# EAGLE design pcb_organizer_sch (EAGLE 9.4.2)
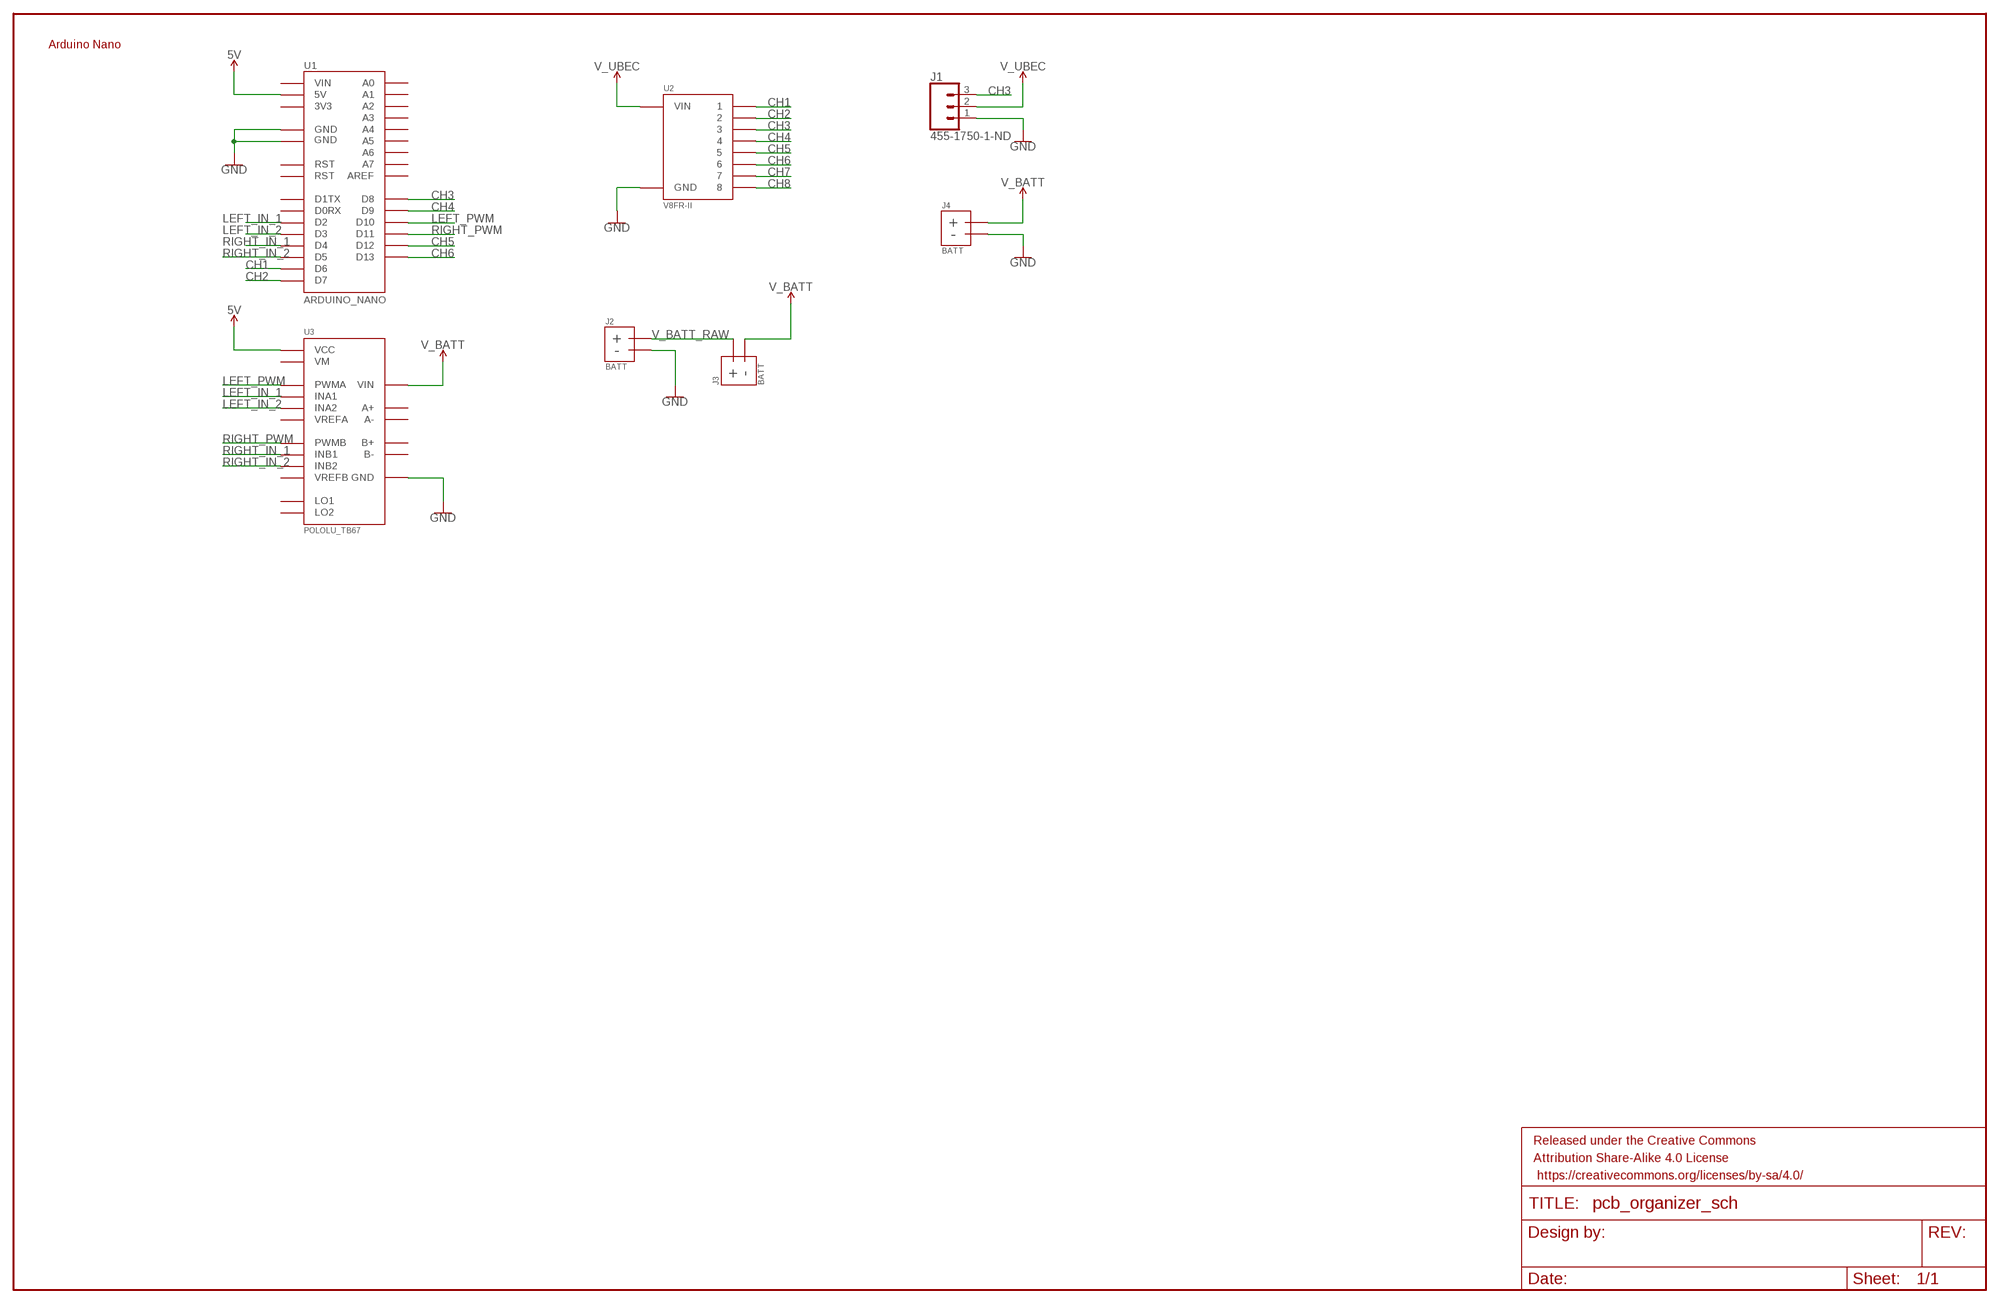
[diagram p0: schematic, sheet 1]

## Parts
FRAME1  FRAME-LEDGER  [CREATIVE_COMMONS]
J1  455-1750-1-ND  CONN_03  [1X03]
J2  BATT  [CONN_2_10AUG]
J3  BATT  [CONN_2_10AUG]
J4  BATT  [CONN_2_10AUG]
U1  ARDUINO_NANO  [ARDUINO_NANO]
U2  V8FR-II  [V8FR-II]
U3  POLOLU_TB67  [POLOLU_TB67]

## Nets
5V: U1.5V U3.VCC
CH1: U1.D6 U2.1
CH2: U1.D7 U2.2
CH3: J1.3 U1.D8 U2.3
CH4: U1.D9 U2.4
CH5: U1.D12 U2.5
CH6: U1.D13 U2.6
CH7: U2.7
CH8: U2.8
GND: J1.1 J2.- J4.- U1.GND U1.GND_@16(GND) U2.GND_1(GND) U2.GND_2(GND) U2.GND_3(GND) U2.GND_4(GND) U2.GND_5(GND) U2.GND_6(GND) U2.GND_7(GND) U2.GND_8(GND) U3.GND U3.GND@14(GND) U3.GND@15(GND)
LEFT_IN_1: U1.D2 U3.INA1
LEFT_IN_2: U1.D3 U3.INA2
LEFT_PWM: U1.D10 U3.PWMA
RIGHT_IN_1: U1.D4 U3.INB1
RIGHT_IN_2: U1.D5 U3.INB2
RIGHT_PWM: U1.D11 U3.PWMB
V_BATT: J3.- J4.+ U3.VIN
V_BATT_RAW: J2.+ J3.+
V_UBEC: J1.2 U2.VIN_1(VIN) U2.VIN_2(VIN) U2.VIN_3(VIN) U2.VIN_4(VIN) U2.VIN_5(VIN) U2.VIN_6(VIN) U2.VIN_7(VIN) U2.VIN_8(VIN)
Unconnected: U1.3V3 U1.A0 U1.A1 U1.A2 U1.A3 U1.A4 U1.A5 U1.A6 U1.A7 U1.AREF U1.D0RX U1.D1TX U1.RST U1.RST@17(RST) U1.VIN U3.A+ U3.A- U3.B+ U3.B- U3.LO1 U3.LO2 U3.VM U3.VREFA U3.VREFB

## Notes on the sheet
- Arduino Nano

## Library data of the parts
FRAME1 = SparkFun-Aesthetics:FRAME-LEDGER: Schematic Frame - Ledger Standard 11x14 US Ledger frame
J1 = SparkFun-Connectors:CONN_03: Multi connection point. Often used as Generic Header-pin footprint for 0.1 inch spaced/style header connections On any of the 0.1 inch spaced packages, you can populate with these: Break Away Headers - Straight <https://www.sparkfun.com/products/116> (PRT-00116) Break Away Male Headers - Right Angle <https://www.sparkfun.com/products/553> (PRT-00553) Female Headers <https://www.sparkfun.com/products/115> (PRT-00115) Break Away Headers - Machine Pin <https://www.sparkfun.com/products/117> (PRT-00117) Break Away Female Headers - Swiss Machine Pin <https://www.sparkfun.com/products/743> (PRT-00743) Stackable Header - 3 Pin (Female, 0.1") <https://www.sparkfun.com/products/13875> (PRT-13875) For SCREWTERMINALS and SPRING TERMINALS visit here: Screw Terimnals on SparkFun.com <https://www.sparkfun.com/search/results?term=Screw+Terminals> (5mm/3.5mm/2.54mm spacing) This device is also useful as a general connection point to wire up your design to another part of your project. Our various solder wires solder well into these plated through hole pads. Hook-Up Wire - Assortment (Stranded, 22 AWG) <https://www.sparkfun.com/products/11375> (PRT-11375) Hook-Up Wire - Assortment (Solid Core, 22 AWG) <https://www.sparkfun.com/products/11367> (PRT-11367) View the entire wire category on our website here <https://www.sparkfun.com/categories/141> Special notes: Molex polarized connector foot print use with SKU : PRT-08232 with associated crimp pins and housings.; PROD_ID: XXX-00000
J2-J4 = CUCombatBots:BATT
U1 = CUCombatBots:ARDUINO_NANO
U2 = CUCombatBots:V8FR-II
U3 = CUCombatBots:POLOLU_TB67

## Board
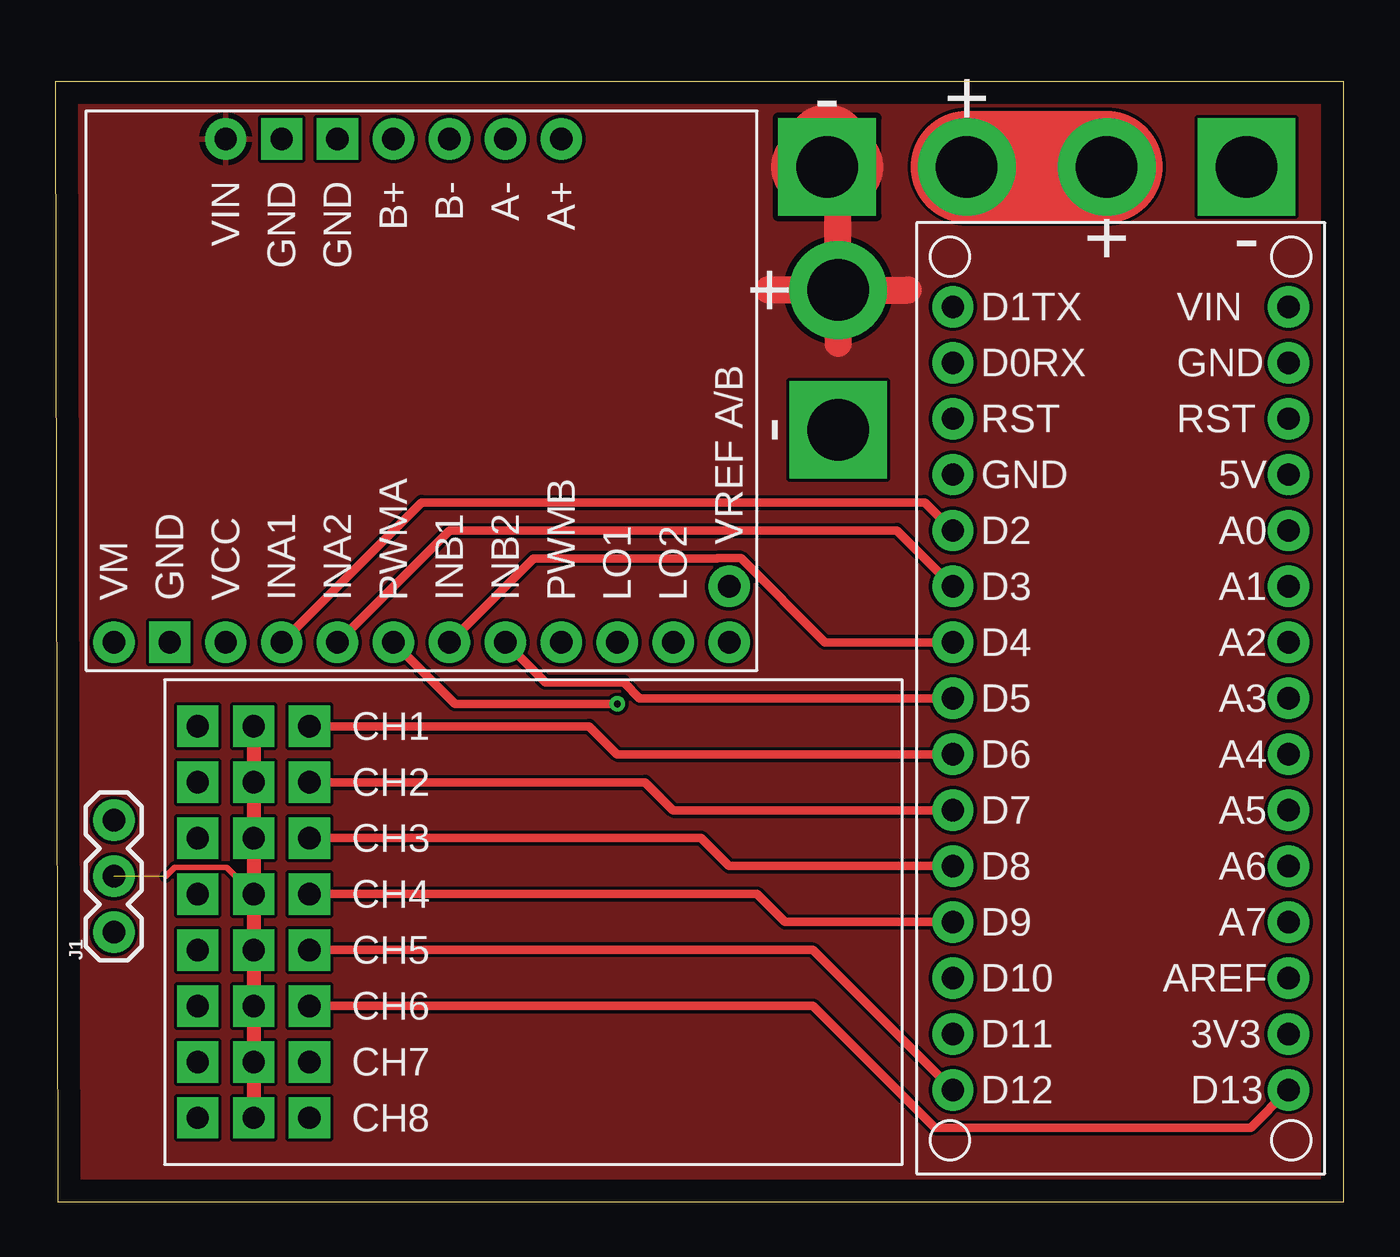
[diagram p1: board, top side]
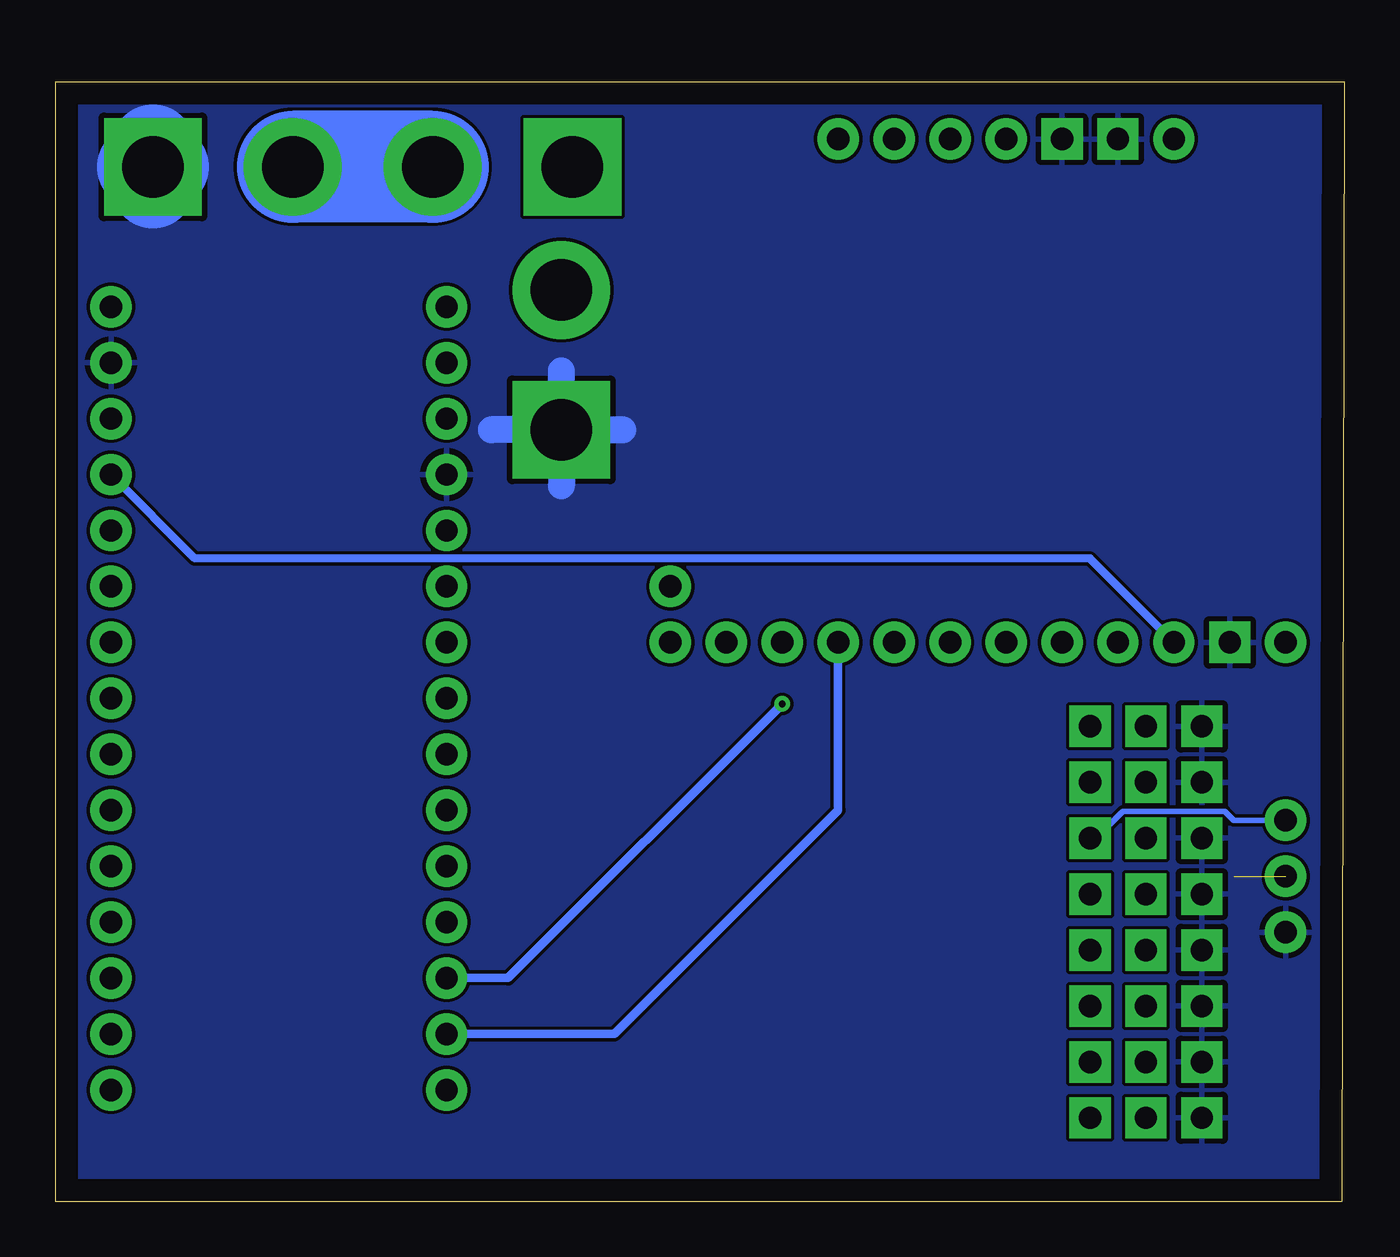
[diagram p2: board, bottom side, seen from below]

Size 58.53 x 50.85 mm. Coordinates in mm from the lower left corner, seen from the top.
Outline: 0.13,0 58.53,0 58.53,50.85 0,50.85 0.13,0
Copper layers (1*16): Top 0.035mm / dielectric 1.5mm / Bottom 0.035mm
Design rules "default *": minimum track width 6mil, minimum drill 3mil, track to track 6mil, track to pad 6mil, pad to pad 6mil, via to via 6mil, smd to smd 6mil, copper to edge 40mil, drill to drill 6mil, minimum pad ring 10mil, minimum via ring 8mil, stop-mask expansion 4mil, vias tented up to drill 0mil, thermal gap 10mil

### Footprints (pad centres in the part's own frame; a part is rotated, then mirrored left to right if it is on the bottom)
1X03 = drill 1.016 pad 1.88: 1 0,0; 2 2.54,0; 3 5.08,0
CONN_2_10AUG = drill 2.794 pad 4.445: + 3.175,0 | drill 2.794 pad 4.445 square: - -3.175,0
ARDUINO_NANO = drill 1.016 pad 1.88: 3V3 7.62,-15.24; 5V 7.62,10.16; A0 7.62,7.62; A1 7.62,5.08; A2 7.62,2.54; A3 7.62,0; A4 7.62,-2.54; A5 7.62,-5.08; A6 7.62,-7.62; A7 7.62,-10.16; AREF 7.62,-12.7; D0RX -7.62,15.24; D1TX -7.62,17.78; D2 -7.62,7.62; D3 -7.62,5.08; D4 -7.62,2.54; D5 -7.62,0; D6 -7.62,-2.54; D7 -7.62,-5.08; D8 -7.62,-7.62; D9 -7.62,-10.16; D10 -7.62,-12.7; D11 -7.62,-15.24; D12 -7.62,-17.78; D13 7.62,-17.78; GND -7.62,10.16; GND_@16 7.62,15.24; RST -7.62,12.7; RST@17 7.62,12.7; VIN 7.62,17.78
V8FR-II = drill 1.016 pad 1.88 square: 1 8.89,10.16; 2 6.35,10.16; 3 3.81,10.16; 4 1.27,10.16; 5 -1.27,10.16; 6 -3.81,10.16; 7 -6.35,10.16; 8 -8.89,10.16; GND_1 8.89,15.24; GND_2 6.35,15.24; GND_3 3.81,15.24; GND_4 1.27,15.24; GND_5 -1.27,15.24; GND_6 -3.81,15.24; GND_7 -6.35,15.24; GND_8 -8.89,15.24; VIN_1 8.89,12.7; VIN_2 6.35,12.7; VIN_3 3.81,12.7; VIN_4 1.27,12.7; VIN_5 -1.27,12.7; VIN_6 -3.81,12.7; VIN_7 -6.35,12.7; VIN_8 -8.89,12.7
POLOLU_TB67 = drill 1.016 pad 1.88: A+ 11.43,-6.35; A- 11.43,-3.81; B+ 11.43,1.27; B- 11.43,-1.27; INA1 -11.43,6.35; INA2 -11.43,3.81; INB1 -11.43,-1.27; INB2 -11.43,-3.81; LO1 -11.43,-8.89; LO2 -11.43,-11.43; PWMA -11.43,1.27; PWMB -11.43,-6.35; VCC -11.43,8.89; VIN 11.43,8.89; VM -11.43,13.97; VREFA -11.43,-13.97; VREFB -8.89,-13.97 | drill 1.016 pad 1.88 square: GND -11.43,11.43; GND@14 11.43,6.35; GND@15 11.43,3.81

### Placement (x,y rotation side)
FRAME1  -36.7,45.72 0 top  (outside the outline)
J1  2.67,12.24 90 top
J2  50.93,46.99 180 top
J3  38.23,46.99 0 top
J4  35.56,38.23 90 top
U1  48.39,22.86 0 top
U2  21.72,12.7 90 top
U3  16.64,36.83 90 top

### Tracks (layer width: path | path; a pad name or v marks a point on that pad's centre or on a via)
5V
  Bottom 0.356: U3.VCC 11.56,29.21 52.2,29.21 U1.5V
CH1
  Top 0.381: U2.1 24.26,21.59 25.53,20.32 U1.D6
CH2
  Top 0.381: U2.2 26.8,19.05 28.07,17.78 U1.D7
CH3
  Top 0.381: U2.3 29.34,16.51 30.61,15.24 U1.D8
  Bottom 0.254: U2.3 11.29,16.51 10.07,17.73 5.42,17.73 5.01,17.32 J1.3
CH4
  Top 0.381: U2.4 31.88,13.97 33.15,12.7 U1.D9
CH5
  Top 0.381: U1.D12 34.42,11.43 U2.5
CH6
  Top 0.381: U2.6 34.42,8.89 39.94,3.37 54.29,3.37 U1.D13
GND
  Bottom 1.219: J4.- 35.56,37.72 | J4.- 38.73,35.05 | J4.- 35.56,32.51 | J4.- 32.77,35.05
  Bottom 3.81: J2.- 54.74,46.99 | J2.- 53.47,46.99 | J2.- 54.1,47.93 | J2.- 54.1,46.1
  pour Bottom: 0.13,0 58.55,0 58.55,50.8 0.13,50.8
LEFT_IN_1
  Top 0.381: U3.INA1 16.64,31.75 39.5,31.75 U1.D2
LEFT_IN_2
  Top 0.381: U3.INA2 17.91,30.48 38.23,30.48 U1.D3
LEFT_PWM  (via drill 0.3)
  Top 0.381: U3.PWMA 18.16,22.61 v25.53,22.61
  Bottom 0.381: v25.53,22.61 37.97,10.16 U1.D10
RIGHT_IN_1
  Top 0.381: U1.D4 34.96,25.4 31.14,29.22 30.08,29.22 30.06,29.21 21.72,29.21 U3.INB1
RIGHT_IN_2
  Top 0.381: U1.D5 26.55,22.86 25.83,23.58 22.27,23.58 U3.INB2
RIGHT_PWM
  Bottom 0.381: U1.D11 33.15,7.62 22.99,17.78 U3.PWMB
V_BATT
  Top 1.219: J4.+ 32.39,41.4 | J4.+ 35.56,46.48 J3.- | J4.+ 38.73,41.4 | J4.+ 35.56,38.99
  Top 3.81: J3.- 34.42,46.99 | J3.- 35.69,46.99 | J3.- 35.05,47.93
  pour Top: 0.13,50.8 0.13,0 58.55,0 58.55,50.8
V_BATT_RAW
  Top 5.08: J3.+ J2.+
  Bottom 5.08: J3.+ J2.+
V_UBEC  (1 unrouted)
  Top 0.254: 8.75,19.05 U2.VIN_2 | 5.01,14.78 5.42,15.19 7.8,15.19 U2.VIN_4
  Top 0.635: U2.VIN_1 U2.VIN_2 U2.VIN_3 U2.VIN_4 U2.VIN_5 U2.VIN_6 U2.VIN_7 U2.VIN_8